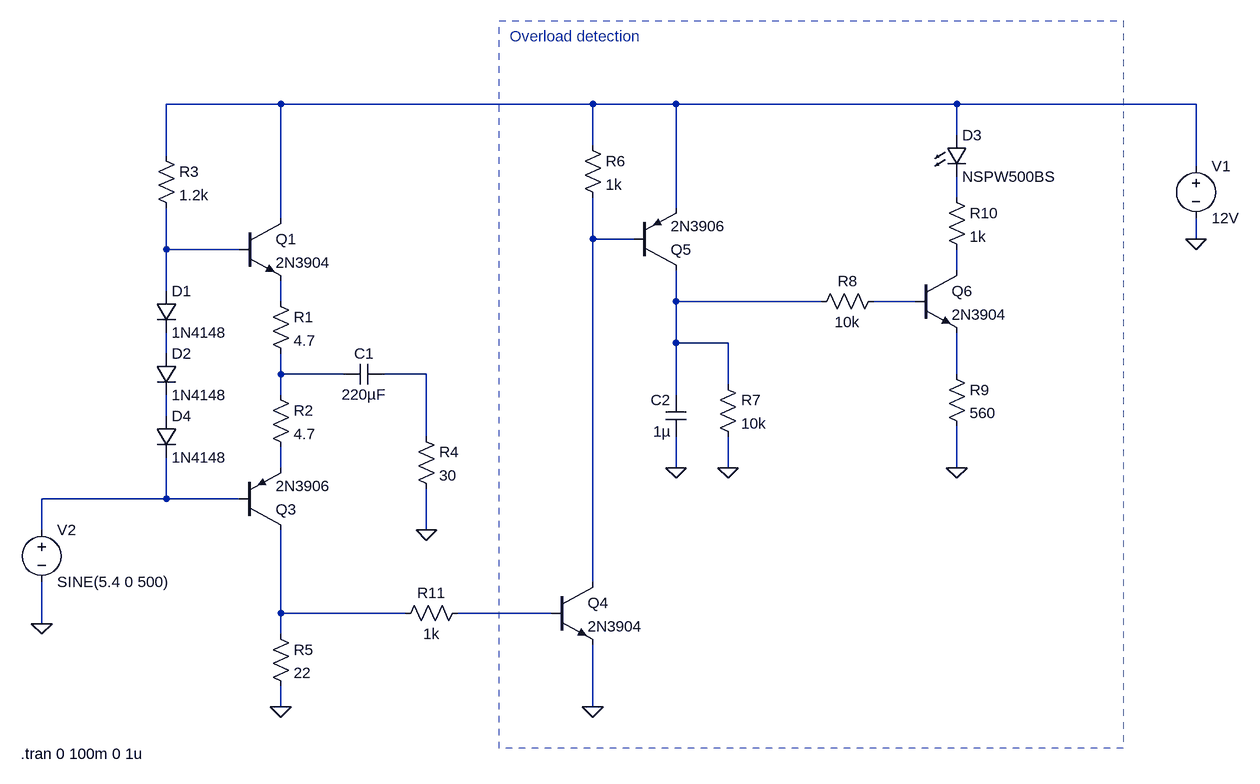
[diagram p0: schematic headphone_amp_v1.asc]
headphone_amp_v1.asc, the LTspice schematic file:
Version 4
SHEET 1 1752 936
WIRE 272 -80 96 -80
WIRE 752 -80 272 -80
WIRE 880 -80 752 -80
WIRE 1312 -80 880 -80
WIRE 1680 -80 1312 -80
WIRE 1312 -32 1312 -80
WIRE 752 -16 752 -80
WIRE 96 0 96 -80
WIRE 1680 16 1680 -80
WIRE 1312 64 1312 32
WIRE 880 80 880 -80
WIRE 272 96 272 -80
WIRE 752 128 752 64
WIRE 816 128 752 128
WIRE 1680 128 1680 96
WIRE 96 144 96 80
WIRE 208 144 96 144
WIRE 1312 176 1312 144
WIRE 96 208 96 144
WIRE 272 224 272 192
WIRE 880 224 880 176
WIRE 1104 224 880 224
WIRE 1248 224 1184 224
WIRE 880 288 880 224
WIRE 960 288 880 288
WIRE 96 304 96 272
WIRE 272 336 272 304
WIRE 368 336 272 336
WIRE 496 336 432 336
WIRE 1312 336 1312 272
WIRE 960 352 960 288
WIRE 272 368 272 336
WIRE 880 368 880 288
WIRE 96 400 96 368
WIRE 496 432 496 336
WIRE 272 480 272 448
WIRE 880 480 880 432
WIRE 960 480 960 432
WIRE 1312 480 1312 416
WIRE 96 528 96 464
WIRE 96 528 -96 528
WIRE 208 528 96 528
WIRE -96 576 -96 528
WIRE 496 576 496 512
WIRE 752 656 752 128
WIRE 272 704 272 576
WIRE 464 704 272 704
WIRE 688 704 544 704
WIRE -96 720 -96 656
WIRE 272 736 272 704
WIRE 272 848 272 816
WIRE 752 848 752 752
FLAG 1680 128 0
FLAG 496 576 0
FLAG 272 848 0
FLAG 752 848 0
FLAG 880 480 0
FLAG 960 480 0
FLAG 1312 480 0
FLAG -96 720 0
SYMBOL npn2 208 96 R0
SYMATTR InstName Q1
SYMATTR Value 2N3904
SYMBOL pnp2 208 576 M180
SYMATTR InstName Q3
SYMATTR Value 2N3906
SYMBOL res 256 208 R0
SYMATTR InstName R1
SYMATTR Value 4.7
SYMBOL res 256 352 R0
SYMATTR InstName R2
SYMATTR Value 4.7
SYMBOL voltage 1680 0 R0
WINDOW 123 0 0 Left 0
WINDOW 39 0 0 Left 0
SYMATTR InstName V1
SYMATTR Value 12V
SYMBOL res 80 -16 R0
SYMATTR InstName R3
SYMATTR Value 1.2k
SYMBOL cap 432 320 R90
WINDOW 0 0 32 VBottom 2
WINDOW 3 32 32 VTop 2
SYMATTR InstName C1
SYMATTR Value 220µF
SYMBOL res 480 416 R0
SYMATTR InstName R4
SYMATTR Value 30
SYMBOL res 256 720 R0
SYMATTR InstName R5
SYMATTR Value 22
SYMBOL npn2 688 656 R0
SYMATTR InstName Q4
SYMATTR Value 2N3904
SYMBOL res 736 -32 R0
SYMATTR InstName R6
SYMATTR Value 1k
SYMBOL pnp2 816 176 M180
SYMATTR InstName Q5
SYMATTR Value 2N3906
SYMBOL diode 80 208 R0
SYMATTR InstName D1
SYMATTR Value 1N4148
SYMBOL diode 80 304 R0
SYMATTR InstName D2
SYMATTR Value 1N4148
SYMBOL cap 896 432 R180
WINDOW 0 24 56 Left 2
WINDOW 3 24 8 Left 2
SYMATTR InstName C2
SYMATTR Value 1µ
SYMBOL res 944 336 R0
SYMATTR InstName R7
SYMATTR Value 10k
SYMBOL res 1200 208 R90
WINDOW 0 0 56 VBottom 2
WINDOW 3 32 56 VTop 2
SYMATTR InstName R8
SYMATTR Value 10k
SYMBOL npn2 1248 176 R0
SYMATTR InstName Q6
SYMATTR Value 2N3904
SYMBOL res 1296 320 R0
SYMATTR InstName R9
SYMATTR Value 560
SYMBOL LED 1296 -32 R0
SYMATTR InstName D3
SYMATTR Value NSPW500BS
SYMATTR Description Diode
SYMATTR Type diode
SYMBOL res 1296 48 R0
SYMATTR InstName R10
SYMATTR Value 1k
SYMBOL voltage -96 560 R0
WINDOW 123 0 0 Left 0
WINDOW 39 0 0 Left 0
SYMATTR InstName V2
SYMATTR Value SINE(5.4 0 500)
SYMBOL res 560 688 R90
WINDOW 0 0 56 VBottom 2
WINDOW 3 32 56 VTop 2
SYMATTR InstName R11
SYMATTR Value 1k
SYMBOL diode 80 400 R0
SYMATTR InstName D4
SYMATTR Value 1N4148
TEXT 624 -184 Left 2 ;Overload detection
TEXT -128 920 Left 2 !.tran 0 100m 0 1u
RECTANGLE Normal 1568 912 608 -208 2

The netlist it stands for:
* headphone_amp_v1.asc
Q1 N001 N004 N006 0 2N3904
Q3 N016 N015 N014 0 2N3906
R1 N006 N010 4.7
R2 N010 N014 4.7
V1 N001 0 12V
R3 N001 N004 1.2k
C1 N011 N010 220µF
R4 N011 0 30
R5 N016 0 22
Q4 N003 N017 0 0 2N3904
R6 N001 N003 1k
Q5 N007 N003 N001 0 2N3906
D1 N004 N009 1N4148
D2 N009 N013 1N4148
C2 0 N007 1µ
R7 N007 0 10k
R8 N008 N007 10k
Q6 N005 N008 N012 0 2N3904
R9 N012 0 560
D3 N001 N002 NSPW500BS
R10 N002 N005 1k
V2 N015 0 SINE(5.4 0 500)
R11 N017 N016 1k
D4 N013 N015 1N4148
.model D D
.lib standard.dio
.model NPN NPN
.model PNP PNP
.lib standard.bjt
* Overload detection
.tran 0 100m 0 1u
.backanno
.end